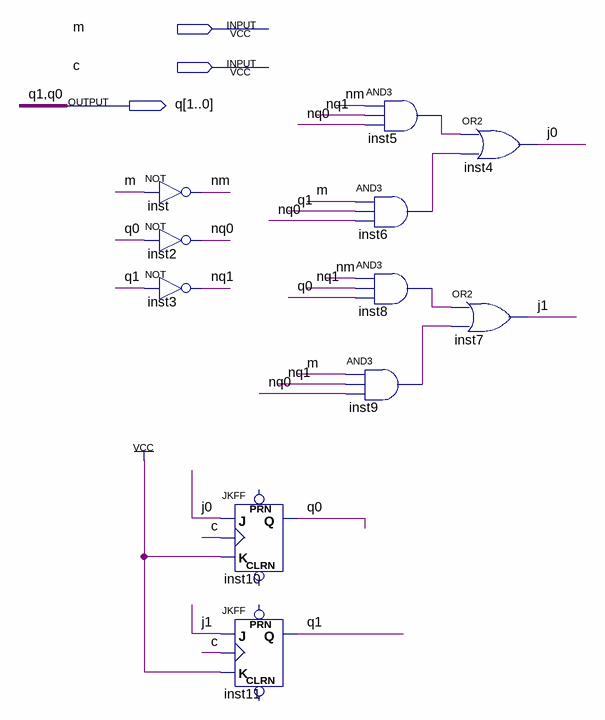
[diagram p0: schematic sheet]
// Quartus schematic s11.bdf as structural Verilog: 11 symbols, 3 pins
module s11 (
  input  m,
  input  c,
  output [1:0] q
);

  wire inst5_out, inst6_out, inst8_out, inst9_out, j0, j1, nm, nq0, nq1;

  not inst (nm, m);
  not inst2 (nq0, q[0]);
  not inst3 (nq1, q[1]);
  JKFF inst10 (.K(1'b1), .J(j0), .CLK(c), .Q(q[0]));  // open: PRN, CLRN
  JKFF inst11 (.K(1'b1), .J(j1), .CLK(c), .Q(q[1]));  // open: PRN, CLRN
  and inst9 (inst9_out, m, nq1, nq0);
  and inst5 (inst5_out, nm, nq1, nq0);
  and inst6 (inst6_out, m, q[1], nq0);
  and inst8 (inst8_out, nm, nq1, q[0]);
  or inst4 (j0, inst5_out, inst6_out);
  or inst7 (j1, inst8_out, inst9_out);
endmodule
